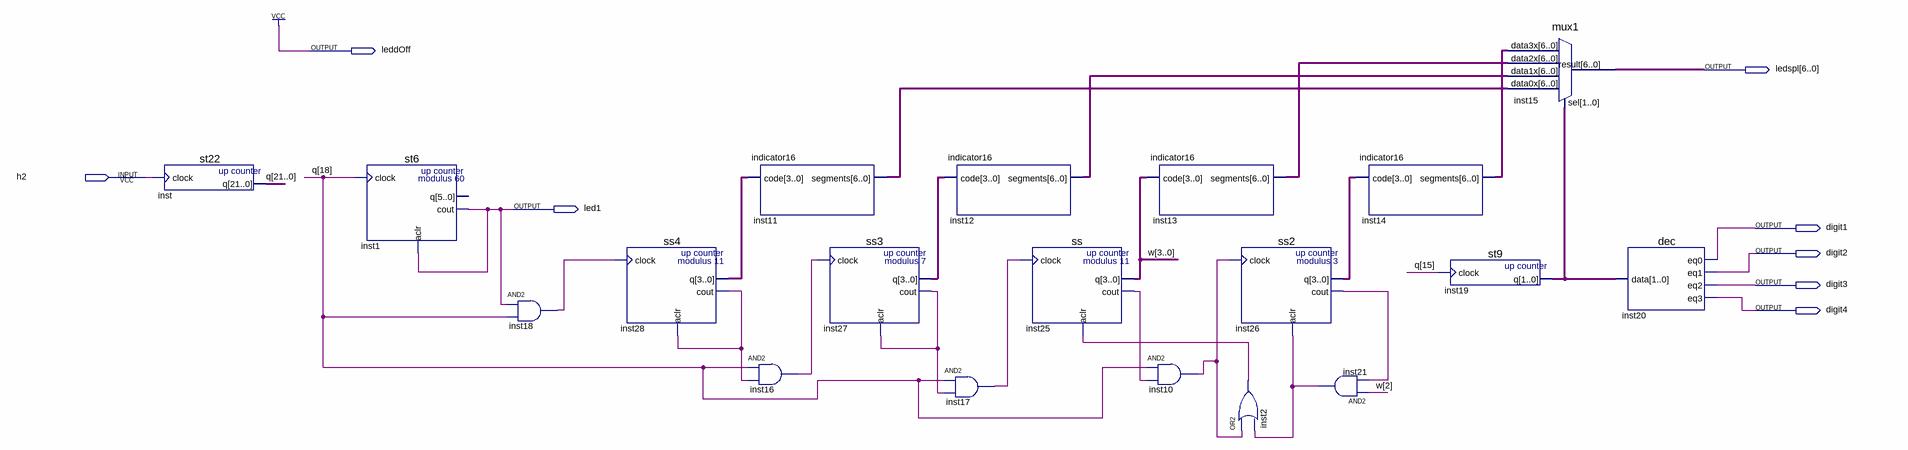
[diagram p0: schematic sheet]
// Quartus schematic chasi2.bdf as structural Verilog: 19 symbols, 8 pins
module chasi2 (
  input  h2,
  output leddOff,
  output [6:0] ledspl,
  output led1,
  output digit1,
  output digit2,
  output digit3,
  output digit4
);

  wire inst2_out, inst10_out, inst16_out, inst17_out, inst18_out, inst21_out, inst25_cout, inst26_cout,
       inst27_cout, inst28_cout;
  wire [1:0] inst19_q;
  wire [3:0] inst26_q, inst27_q, inst28_q, w;
  wire [6:0] inst11_segments, inst12_segments, inst13_segments, inst14_segments;
  wire [21:0] q;

  st22 inst (.clock(h2), .q(q));
  st6 inst1 (.clock(q[18]), .aclr(led1), .cout(led1));  // open: q
  and inst18 (inst18_out, led1, q[18]);
  ss4 inst28 (.clock(inst18_out), .aclr(inst28_cout), .q(inst28_q), .cout(inst28_cout));
  indicator16 inst11 (.code(inst28_q), .segments(inst11_segments));
  and inst16 (inst16_out, q[18], inst28_cout);
  ss3 inst27 (.clock(inst16_out), .aclr(inst27_cout), .q(inst27_q), .cout(inst27_cout));
  indicator16 inst12 (.code(inst27_q), .segments(inst12_segments));
  and inst17 (inst17_out, q[18], inst27_cout);
  ss inst25 (.clock(inst17_out), .aclr(inst2_out), .q(w), .cout(inst25_cout));
  indicator16 inst13 (.code(w), .segments(inst13_segments));
  and inst10 (inst10_out, q[18], inst25_cout);
  ss2 inst26 (.clock(inst10_out), .aclr(inst21_out), .q(inst26_q), .cout(inst26_cout));
  or inst2 (inst2_out, inst10_out, inst21_out);
  and inst21 (inst21_out, w[2], inst26_cout);
  indicator16 inst14 (.code(inst26_q), .segments(inst14_segments));
  st9 inst19 (.clock(q[15]), .q(inst19_q));
  mux1 inst15 (
    .data3x(inst14_segments), .data2x(inst13_segments), .data1x(inst12_segments), .data0x(inst11_segments),
    .sel(inst19_q), .result(ledspl));
  dec inst20 (.data(inst19_q), .eq0(digit1), .eq1(digit2), .eq2(digit3), .eq3(digit4));

  assign leddOff = 1'b1;
endmodule
